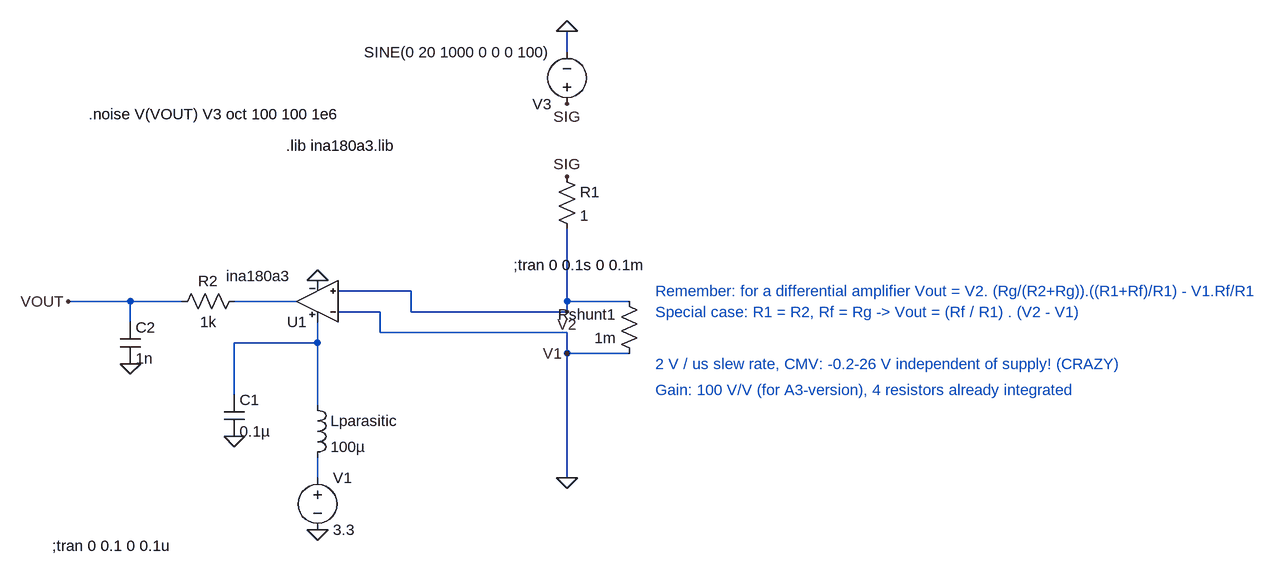
[diagram p0: schematic current_meas_INA180A3.asc]
current_meas_INA180A3.asc, the LTspice schematic file:
Version 4
SHEET 1 1244 680
WIRE 96 -192 96 -224
WIRE -144 176 -256 176
WIRE -576 192 -672 192
WIRE -496 192 -576 192
WIRE -320 192 -416 192
WIRE 96 192 96 80
WIRE 192 192 96 192
WIRE -192 208 -256 208
WIRE -144 208 -144 176
WIRE 96 208 96 192
WIRE 96 208 -144 208
WIRE -576 224 -576 192
WIRE -192 240 -192 208
WIRE 96 240 -192 240
WIRE -288 256 -288 224
WIRE -288 256 -416 256
WIRE 96 272 96 240
WIRE 192 272 96 272
WIRE -416 336 -416 256
WIRE -288 352 -288 256
WIRE -288 464 -288 432
WIRE 96 464 96 272
FLAG 96 -224 0
FLAG 96 464 0
FLAG 96 272 V1
FLAG 96 208 V2
FLAG -288 544 0
FLAG -416 400 0
FLAG -288 160 0
FLAG 96 -112 SIG
FLAG 96 0 SIG
FLAG -576 288 0
FLAG -672 192 VOUT
SYMBOL res 208 288 R180
WINDOW 0 36 76 Left 2
WINDOW 3 36 40 Left 2
SYMATTR InstName Rshunt1
SYMATTR Value 1m
SYMBOL OpAmps\\INA180a3 -288 256 R180
WINDOW 3 41 103 Left 2
SYMATTR Value ina180a3
SYMATTR InstName U1
SYMATTR Prefix ""
SYMBOL voltage -288 448 R0
WINDOW 123 0 0 Left 0
WINDOW 39 0 0 Left 0
SYMATTR InstName V1
SYMATTR Value 3.3
SYMBOL ind -304 336 R0
SYMATTR InstName Lparasitic
SYMATTR Value 100µ
SYMBOL cap -432 336 R0
SYMATTR InstName C1
SYMATTR Value 0.1µ
SYMBOL res 80 -16 R0
SYMATTR InstName R1
SYMATTR Value 1
SYMBOL voltage 96 -96 R180
WINDOW 123 0 0 Left 0
WINDOW 39 0 0 Left 0
SYMATTR InstName V3
SYMATTR Value SINE(0 20 1000 0 0 0 100)
SYMBOL res -400 176 R90
WINDOW 0 0 56 VBottom 2
WINDOW 3 32 56 VTop 2
SYMATTR InstName R2
SYMATTR Value 1k
SYMBOL cap -592 224 R0
SYMATTR InstName C2
SYMATTR Value 1n
TEXT 216 136 Right 2 !;tran 0 0.1s 0 0.1m
TEXT -336 -48 Left 2 !.lib ina180a3.lib
TEXT 232 176 Left 2 ;Remember: for a differential amplifier Vout = V2. (Rg/(R2+Rg)).((R1+Rf)/R1) - V1.Rf/R1
TEXT 232 208 Left 2 ;Special case: R1 = R2, Rf = Rg -> Vout = (Rf / R1) . (V2 - V1)
TEXT 232 288 Left 2 ;2 V / us slew rate, CMV: -0.2-26 V independent of supply! (CRAZY)
TEXT 232 328 Left 2 ;Gain: 100 V/V (for A3-version), 4 resistors already integrated
TEXT -696 568 Left 2 !;tran 0 0.1 0 0.1u
TEXT -640 -96 Left 2 !.noise V(VOUT) V3 oct 100 100 1e6

The netlist it stands for:
* current_meas_INA180A3.asc
Rshunt1 0 V2 1m
XU1 V2 0 N002 0 N001 ina180a3  ; pins INP INN VCC GND OUT
V1 N003 0 3.3
Lparasitic N002 N003 100µ
C1 N002 0 0.1µ
R1 SIG V2 1
V3 SIG 0 SINE(0 20 1000 0 0 0 100)
R2 N001 VOUT 1k
C2 VOUT 0 1n
;tran 0 0.1s 0 0.1m
.lib ina180a3.lib
* Remember: for a differential amplifier Vout = V2. (Rg/(R2+Rg)).((R1+Rf)/R1) - V1.Rf/R1
* Special case: R1 = R2, Rf = Rg -> Vout = (Rf / R1) . (V2 - V1)
* 2 V / us slew rate, CMV: -0.2-26 V independent of supply! (CRAZY)
* Gain: 100 V/V (for A3-version), 4 resistors already integrated
;tran 0 0.1 0 0.1u
.noise V(VOUT) V3 oct 100 100 1e6
.backanno
.end